# Altium schematic sheet ESC.SchDoc (part 1 of 3)